# Altium schematic sheet Multivibrator.SchDoc
size A4
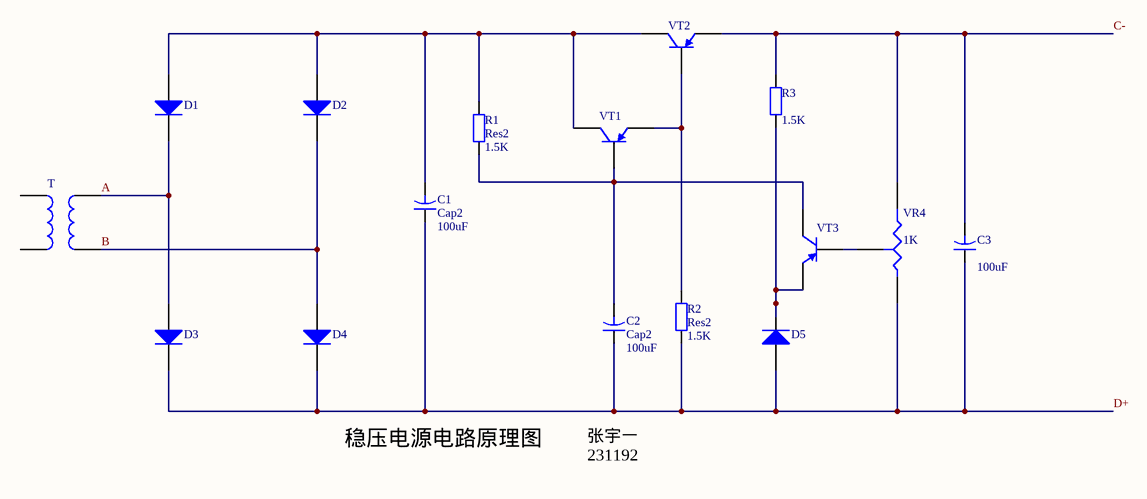
[diagram p0: Multivibrator.SchDoc]

## Parts
C1  Cap2  value 100uF  [RAD-0.3]
C2  Cap2  value 100uF  [RAD-0.3]
C3  value 100uF  [RAD-0.3]  (hidden comment: Cap2)
D1  Diode 1N4004  [DIODE-0.4]  (value not drawn)
D2  Diode 1N4004  [DIODE-0.4]  (value not drawn)
D3  Diode 1N4004  [DIODE-0.4]  (value not drawn)
D4  Diode 1N4004  [DIODE-0.4]  (value not drawn)
D5  Diode 1N4004  [DIODE-0.4]  (value not drawn)
R1  Res2  value 1.5K  [AXIAL-0.3]
R2  Res2  value 1.5K  [AXIAL-0.3]
R3  value 1.5K  [AXIAL-0.3]  (hidden comment: Res2)
T  Trans  [TRANS]  (value not drawn)
VR4  value 1K  [VR3]  (hidden comment: Res Tap)
VT1  2N3906  [TO92A]  (value not drawn)
VT2  2N3906  [TO92A]  (value not drawn)
VT3  2N3906  [TO92A]  (value not drawn)

## Nets
A: D1.2(K) D3.1(A) T.3
B: D2.2(K) D4.1(A) T.4
C-: C3.2 R3.2 VR4.2(B) VT2.1(E)
D+: C1.1 C2.1 C3.1 D3.2(K) D4.2(K) D5.1(A) R2.1 VR4.1(A)
NetC1_2: C1.2 D1.1(A) D2.1(A) R1.2 VT1.3(C) VT2.3(C)
NetC2_2: C2.2 R1.1 VT1.2(B) VT3.3(C)
NetD5_2: D5.2(K) R3.1 VT3.1(E)
NetR2_2: R2.2 VT1.1(E) VT2.2(B)
NetVR4_3: VR4.3(TAP) VT3.2(B)

Not connected (* = marked no-connect by the designer): T 1 2

## Notes on the sheet
- 稳压电源电路原理图
- 张宇一
  231192
  20191000663

## Library data of the parts
C1-C3 = Cap2: Capacitor; Published: 23-Sep-2002; PackageReference: CAPR5-4X5; Publisher: Altium Limited; PackageDescription: Capacitor; 2 Leads
D1-D5 = Diode 1N4004: 1 Amp General Purpose Rectifier; Published: 8-Jun-2000; LatestRevisionDate: 17-Jul-2002; LatestRevisionNote: Re-released for DXP Platform.; DatasheetVersion: 1998; PackageVersion: Aug-1999; PackageReference: DO-41; Publisher: Altium Limited; PackageDescription: Diode, Axial; Body 5.2 x 2.7 mm (LxDia. max), Lead Dia. 0.86 mm (max); Code_JEDEC: DO-204-AL; ComponentLink1Description: Manufacturer Link; ComponentLink1URL: http://www.fairchildsemi.com/; ComponentLink2Description: Datasheet; ComponentLink2URL: http://www.fairchildsemi.com/ds/1N%2F1N4001.pdf
R1-R3 = Res2: Resistor; Published: 8-Jun-2000; LatestRevisionDate: 17-Jul-2002; LatestRevisionNote: Re-released for DXP Platform.; PackageReference: AXIAL-0.4; Publisher: Altium Limited; PackageDescription: Axial Device, Thru-Hole; 2 Leads; 0.4 in Pin Spacing
T = Trans: Transformer; Published: 24-Mar-1999; LatestRevisionDate: 08-Jul-2005; LatestRevisionNote: Mech Layer 1 removed.; PackageReference: TRANS; Publisher: Altium Limited; PackageDescription: Transformer; 4 Leads
VR4 = Res Tap: Tapped Resistor; Sim Note: Enter the Resistance value and the set point into parameter fields.; Set Position: 0.5; Published: 24-Mar-1999; LatestRevisionDate: 17-Jul-2002; LatestRevisionNote: Re-released for DXP Platform.; PackageReference: VR3; Publisher: Altium Limited; PackageDescription: Variable Resistor, Thru-Hole; 3 Leads
VT1-VT3 = 2N3906: PNP General Purpose Amplifier; Published: 8-Jun-2000; LatestRevisionDate: 15-Jan-2003; LatestRevisionNote: PCB Footprint 'BCY-W3/D4.7' replaced; DatasheetVersion: 1997; PackageVersion: Sep-1998; PackageReference: TO-92A; Publisher: Altium Limited; PackageDescription: TO, Flat Index; 3 In-Line, Axial Leads; Body Dia. 4.5mm; Leads 0.51 x 0.48 mm (max); ComponentLink1Description: Manufacturer Link; ComponentLink1URL: http://www.fairchildsemi.com/; ComponentLink2Description: Datasheet; ComponentLink2URL: http://www.fairchildsemi.com/ds/2N%2F2N3906.pdf